# Altium schematic sheet P05_BNO055.SchDoc
size 246 x 182 mm
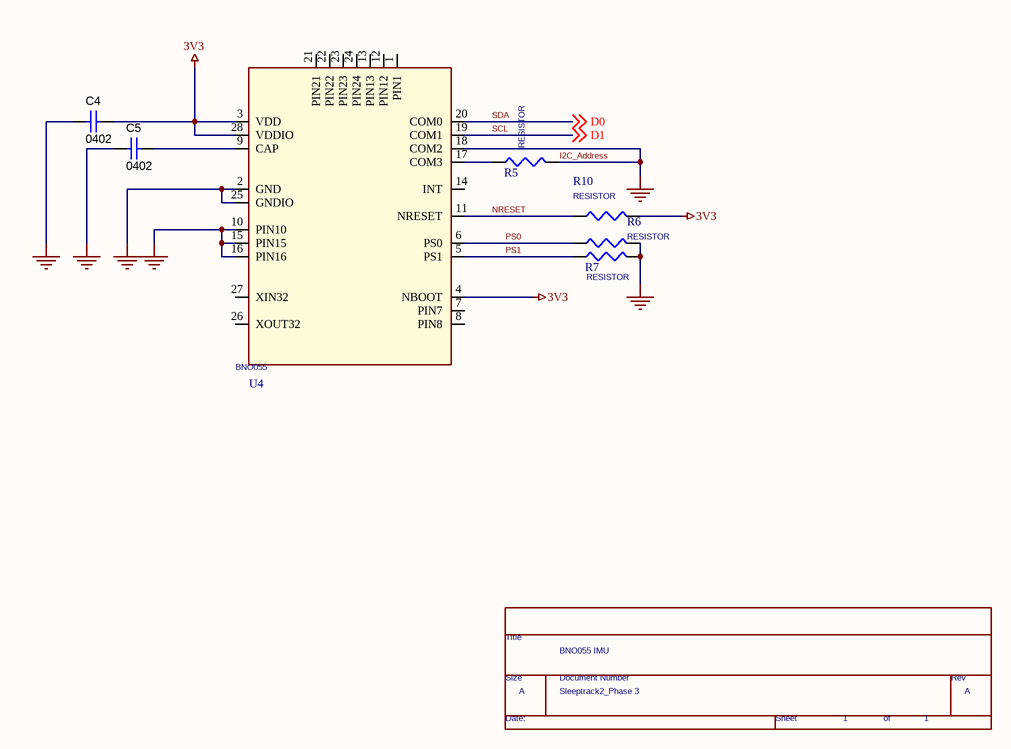
[diagram p0: P05_BNO055.SchDoc]

## Parts
*  Doc: Sleeptrack2_Phase 3  RevCode: A  Title: BNO055 IMU  Page Number: 1  (hidden comment: TitleBlock0)  (graphical)
C4  Cap_Case: 0402  [0402L]  (hidden comment: 885012205037)
C5  Cap_Case: 0402  [0402L]  (hidden comment: 885012205037)
R5  RESISTOR
R6  RESISTOR
R7  RESISTOR
R10  RESISTOR
U4  BNO055  [LCCS50P520X380X118-28N]

## Nets
3V3: C4.1 R10.2 U4.3(VDD) U4.4(NBOOT) U4.28(VDDIO)
I2C_Address: C4.2 C5.2 R5.2 R6.2 R7.2 U4.2(GND) U4.10(PIN10) U4.15(PIN15) U4.16(PIN16) U4.18(COM2) U4.25(GNDIO)  [also labelled GND]
NRESET: R10.1 U4.11(NRESET)
PS0: R6.1 U4.6(PS0)
PS1: R7.1 U4.5(PS1)
SCL: U4.19(COM1) ; off-sheet D1  [also labelled D1]
SDA: U4.20(COM0) ; off-sheet D0  [also labelled D0]
NetC5_1: C5.1 U4.9(CAP)
NetR5_1: R5.1 U4.17(COM3)

Not connected (* = marked no-connect by the designer): U4 1(PIN1) 7(PIN7) 8(PIN8) 12(PIN12) 13(PIN13) 14(INT) 21(PIN21) 22(PIN22) 23(PIN23) 24(PIN24) 26(XOUT32) 27(XIN32)

## Notes on the sheet
- (in symbol TitleBlock0) Title; Size; Document Number; Rev; Date:; Sheet; of

## Library data of the parts
C4 = 885012205037: CAP, CERM, 0.1 µF, 16 V, +/- 10%, X7R, 0402; Manufacturer: Wurth Elektronik; Polarized: N; CompType: Capacitor; Value: 0.1uF; ValueDisplayed: 0.1µF; U/M: EA; Cap_F: 0.0000001; Tolerance_%: 10; Value1: Unknown; VDC_V: 16; Value2: 16V; TaMin_C: -55; TaMax_C: 125; AEC Category: Q200; SymbolVersion: 2008-07-09; PartNumber: 885012205037; PackageReference: 0402; RoHS: Y; MountType: SMT; Technology: Ceramic; TempCo: X7R; Published: 2008-06-19; Publisher: Texas Instruments; LatestRevisionDate: 2016-02-01; ComponentLink1Description: Datasheet link; ComponentLink1URL: http://katalog.we-online.de/pbs/datasheet/885012205037.pdf; Supplier 1: Digi-Key; Supplier Part Number 1: 732-7532-1-ND; Supplier 2: Mouser; Supplier Part Number 2: 710-885012205037; AEC Qualified: N; AEC Grade: N/A
C5 = 885012205037: CAP, CERM, 0.1 µF, 16 V, +/- 10%, X7R, 0402; Manufacturer: Wurth Elektronik; Polarized: N; CompType: Capacitor; Value: 0.1uF; U/M: EA; Cap_F: 0.0000001; Tolerance_%: 10; Value1: Unknown; VDC_V: 16; TaMin_C: -55; TaMax_C: 125; AEC Category: Q200; ValueDisplayed: 0.1µF; Value2: 16V; SymbolVersion: 2008-07-09; PartNumber: 885012205037; PackageReference: 0402; RoHS: Y; MountType: SMT; Technology: Ceramic; Published: 2008-06-19; Publisher: Texas Instruments; LatestRevisionDate: 2016-02-01; ComponentLink1Description: Datasheet link; ComponentLink1URL: http://katalog.we-online.de/pbs/datasheet/885012205037.pdf; Supplier 1: Digi-Key; Supplier Part Number 1: 732-7532-1-ND; Supplier 2: Mouser; Supplier Part Number 2: 710-885012205037; AEC Qualified: N; AEC Grade: N/A; TempCo: X7R
* = TitleBlock0: Page Create Date: March  8, 1995; Page Size: A; Page Count: 1